# Altium schematic sheet PC_PS2.SchDoc: PC PS2
size A4; Organization: Altium Limited.; Address1: Level 3, 12a Rodborough Rd; Address2: Frenchs Forest 2086; Address3: NSW; Address4: AUSTRALIA; SheetNumber: 1; SheetTotal: 100
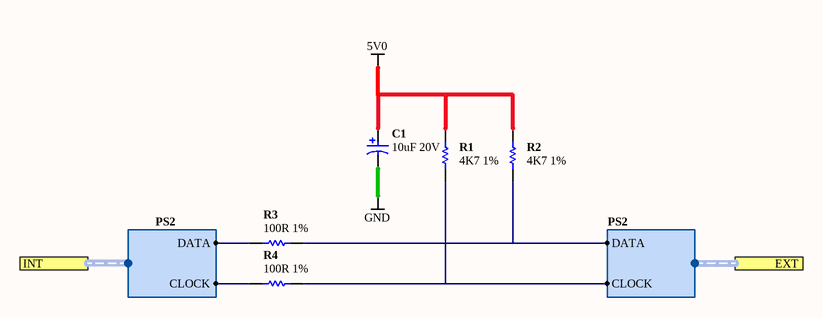
[diagram p0: PC_PS2.SchDoc]

## Parts
C1  10uF 20V  [CAPC3528-STAR]
R1  4K7 1%  [RESC1005-STAR]
R2  4K7 1%  [RESC1005-STAR]
R3  100R 1%  [RESC1005-STAR]
R4  100R 1%  [RESC1005-STAR]

## Ports
EXT (harness PS2), INT (harness PS2)

## Harnesses
PS2: DATA, CLOCK

## Nets
5V0: C1.1 R1.1 R2.1
GND: C1.2
NetR1_2: R1.2 R4.2 ; port EXT.CLOCK
NetR2_2: R2.2 R3.2 ; port EXT.DATA
NetR3_1: R3.1 ; port INT.DATA
NetR4_1: R4.1 ; port INT.CLOCK

## Notes on the sheet
- Sheet Title
- Project Title
- Size:
- Date:
- A4
- Assy:
- Time:
- Revision:
- Sheet
- of
- File:

## Library data of the parts
C1 = D-101-0007: Capacitor, Tantalum, 10uF 10% 20V MCCT-B (3528); Polarity: Polarized; Category: Capacitor; Capacitance: 10 uF; Mounting Technology: Surface Mount; Rated Voltage: 20 V; Status: Production; Technology: Tantalum; Tolerance: 10 %
R1 R2 = D-100-0088: Resistor, 4K7 1% 0402 (1005); Power Rating: 63 mW; Resistance: 4.7 K; Category: Resistor; Mounting Technology: Surface Mount; Status: Production; Tolerance: 1 %
R3 R4 = D-100-0131: Resistor, 100R 1% 0402 (1005); Power Rating: 63 mW; Category: Resistor; Mounting Technology: Surface Mount; Resistance: 100 R; Status: Production; Tolerance: 1 %